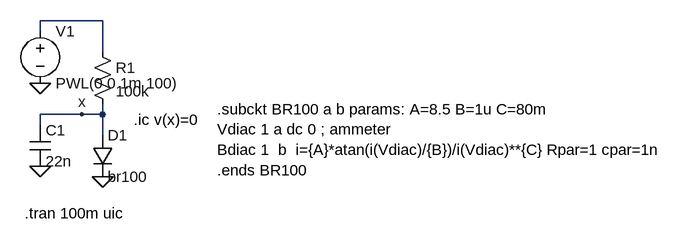
[diagram p0: schematic Draft1.asc]
Draft1.asc, the LTspice schematic file:
Version 4
SHEET 1 880 680
WIRE -16 -48 -112 -48
WIRE -112 -32 -112 -48
WIRE -16 0 -16 -48
WIRE -48 96 -112 96
WIRE -16 96 -16 80
WIRE -16 96 -48 96
WIRE -112 112 -112 96
WIRE -16 128 -16 96
FLAG -16 192 0
FLAG -112 176 0
FLAG -48 96 x
FLAG -112 48 0
SYMBOL res -32 -16 R0
SYMATTR InstName R1
SYMATTR Value 100k
SYMBOL cap -128 112 R0
SYMATTR InstName C1
SYMATTR Value 22n
SYMBOL diode -32 128 R0
SYMATTR InstName D1
SYMATTR Value br100
SYMATTR Prefix xD
SYMBOL voltage -112 -48 R0
WINDOW 123 0 0 Left 2
WINDOW 39 0 0 Left 2
SYMATTR InstName V1
SYMATTR Value PWL(0 0 1m 100)
TEXT 160 88 Left 2 !.subckt BR100 a b params: A=8.5 B=1u C=80m\nVdiac 1 a dc 0 ; ammeter\nBdiac 1  b  i={A}*atan(i(Vdiac)/{B})/i(Vdiac)**{C} Rpar=1 cpar=1n\n.ends BR100
TEXT -136 248 Left 2 !.tran 100m uic
TEXT 32 104 Left 2 !.ic v(x)=0

The netlist it stands for:
* Draft1.asc
R1 N001 x 100k
C1 x 0 22n
XD1 x 0 br100  ; pins + -
V1 N001 0 PWL(0 0 1m 100)
.subckt BR100 a b params: A=8.5 B=1u C=80m
Vdiac 1 a dc 0 ; ammeter
Bdiac 1  b  i={A}*atan(i(Vdiac)/{B})/i(Vdiac)**{C} Rpar=1 cpar=1n
.ends BR100
.tran 100m uic
.ic v(x)=0
.backanno
.end